# EasyEDA schematic SCH.json

## Sheets
1 Main: TITLE: Main; REV: 1.0; Date: 2022-08-12; Sheet: 1/1; Drawn By: joetelaa0; Company: Your Company
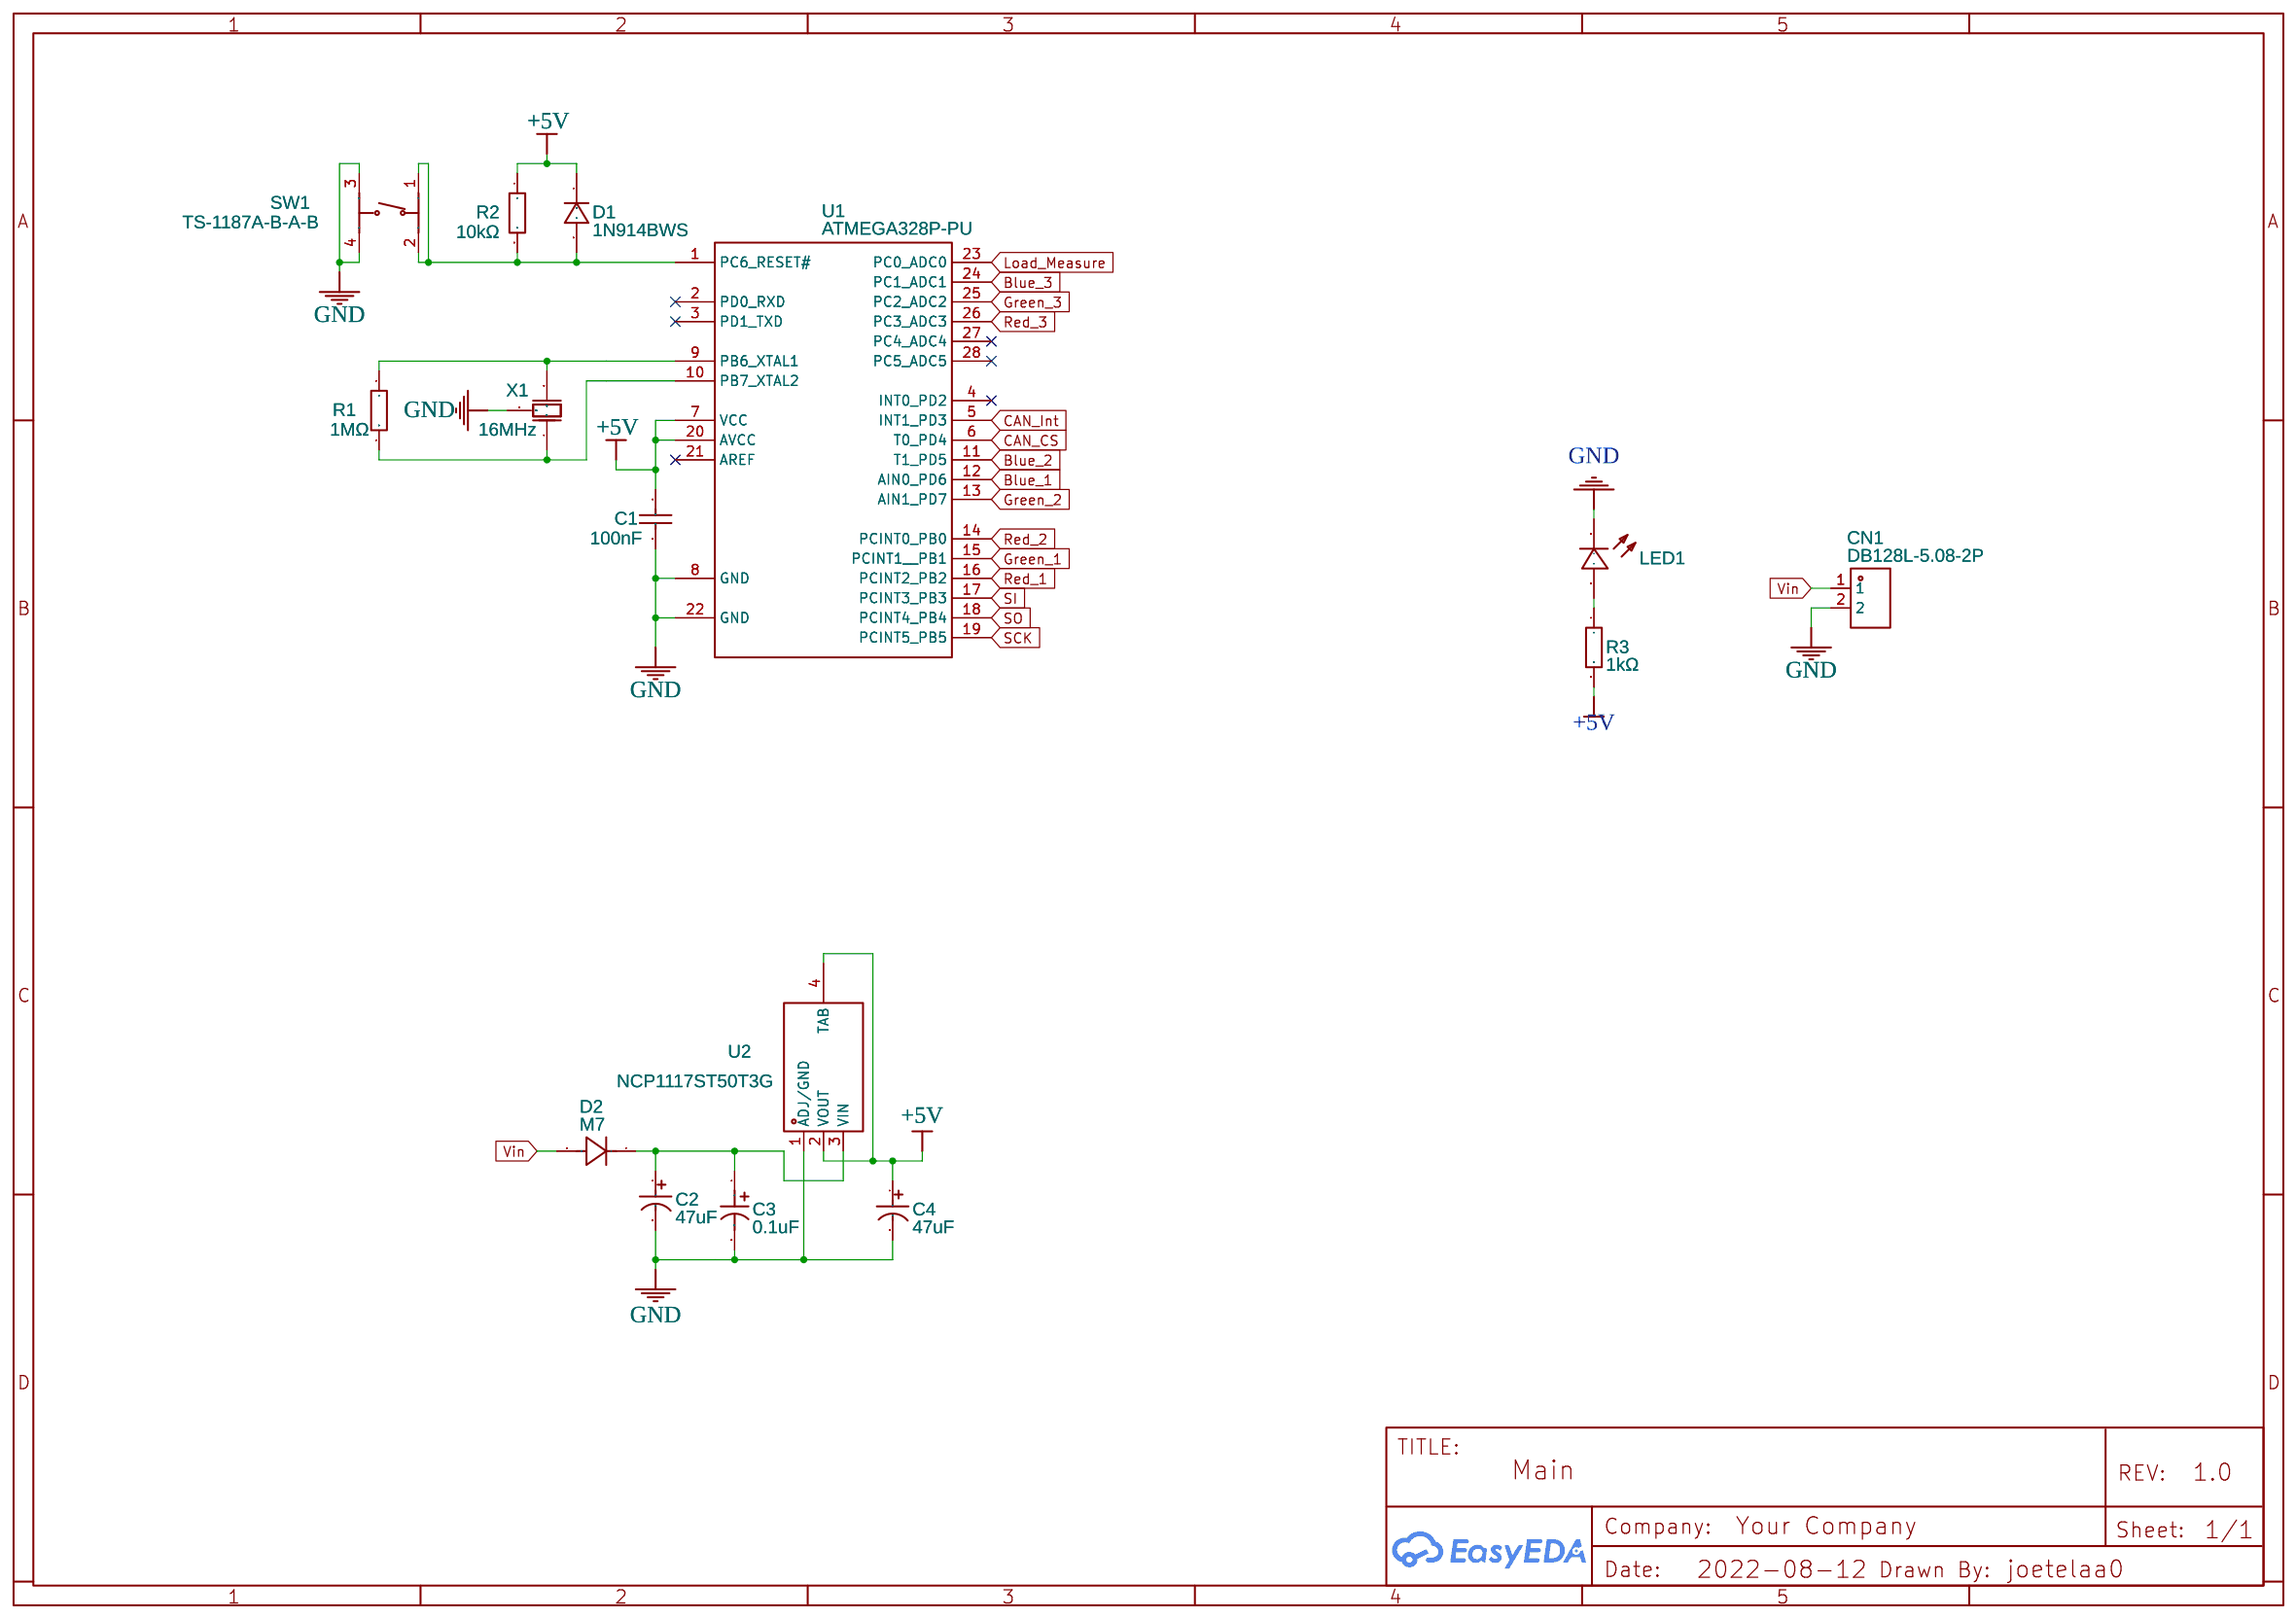
[diagram p0: Main]
2 LED Driver: TITLE: LED Driver
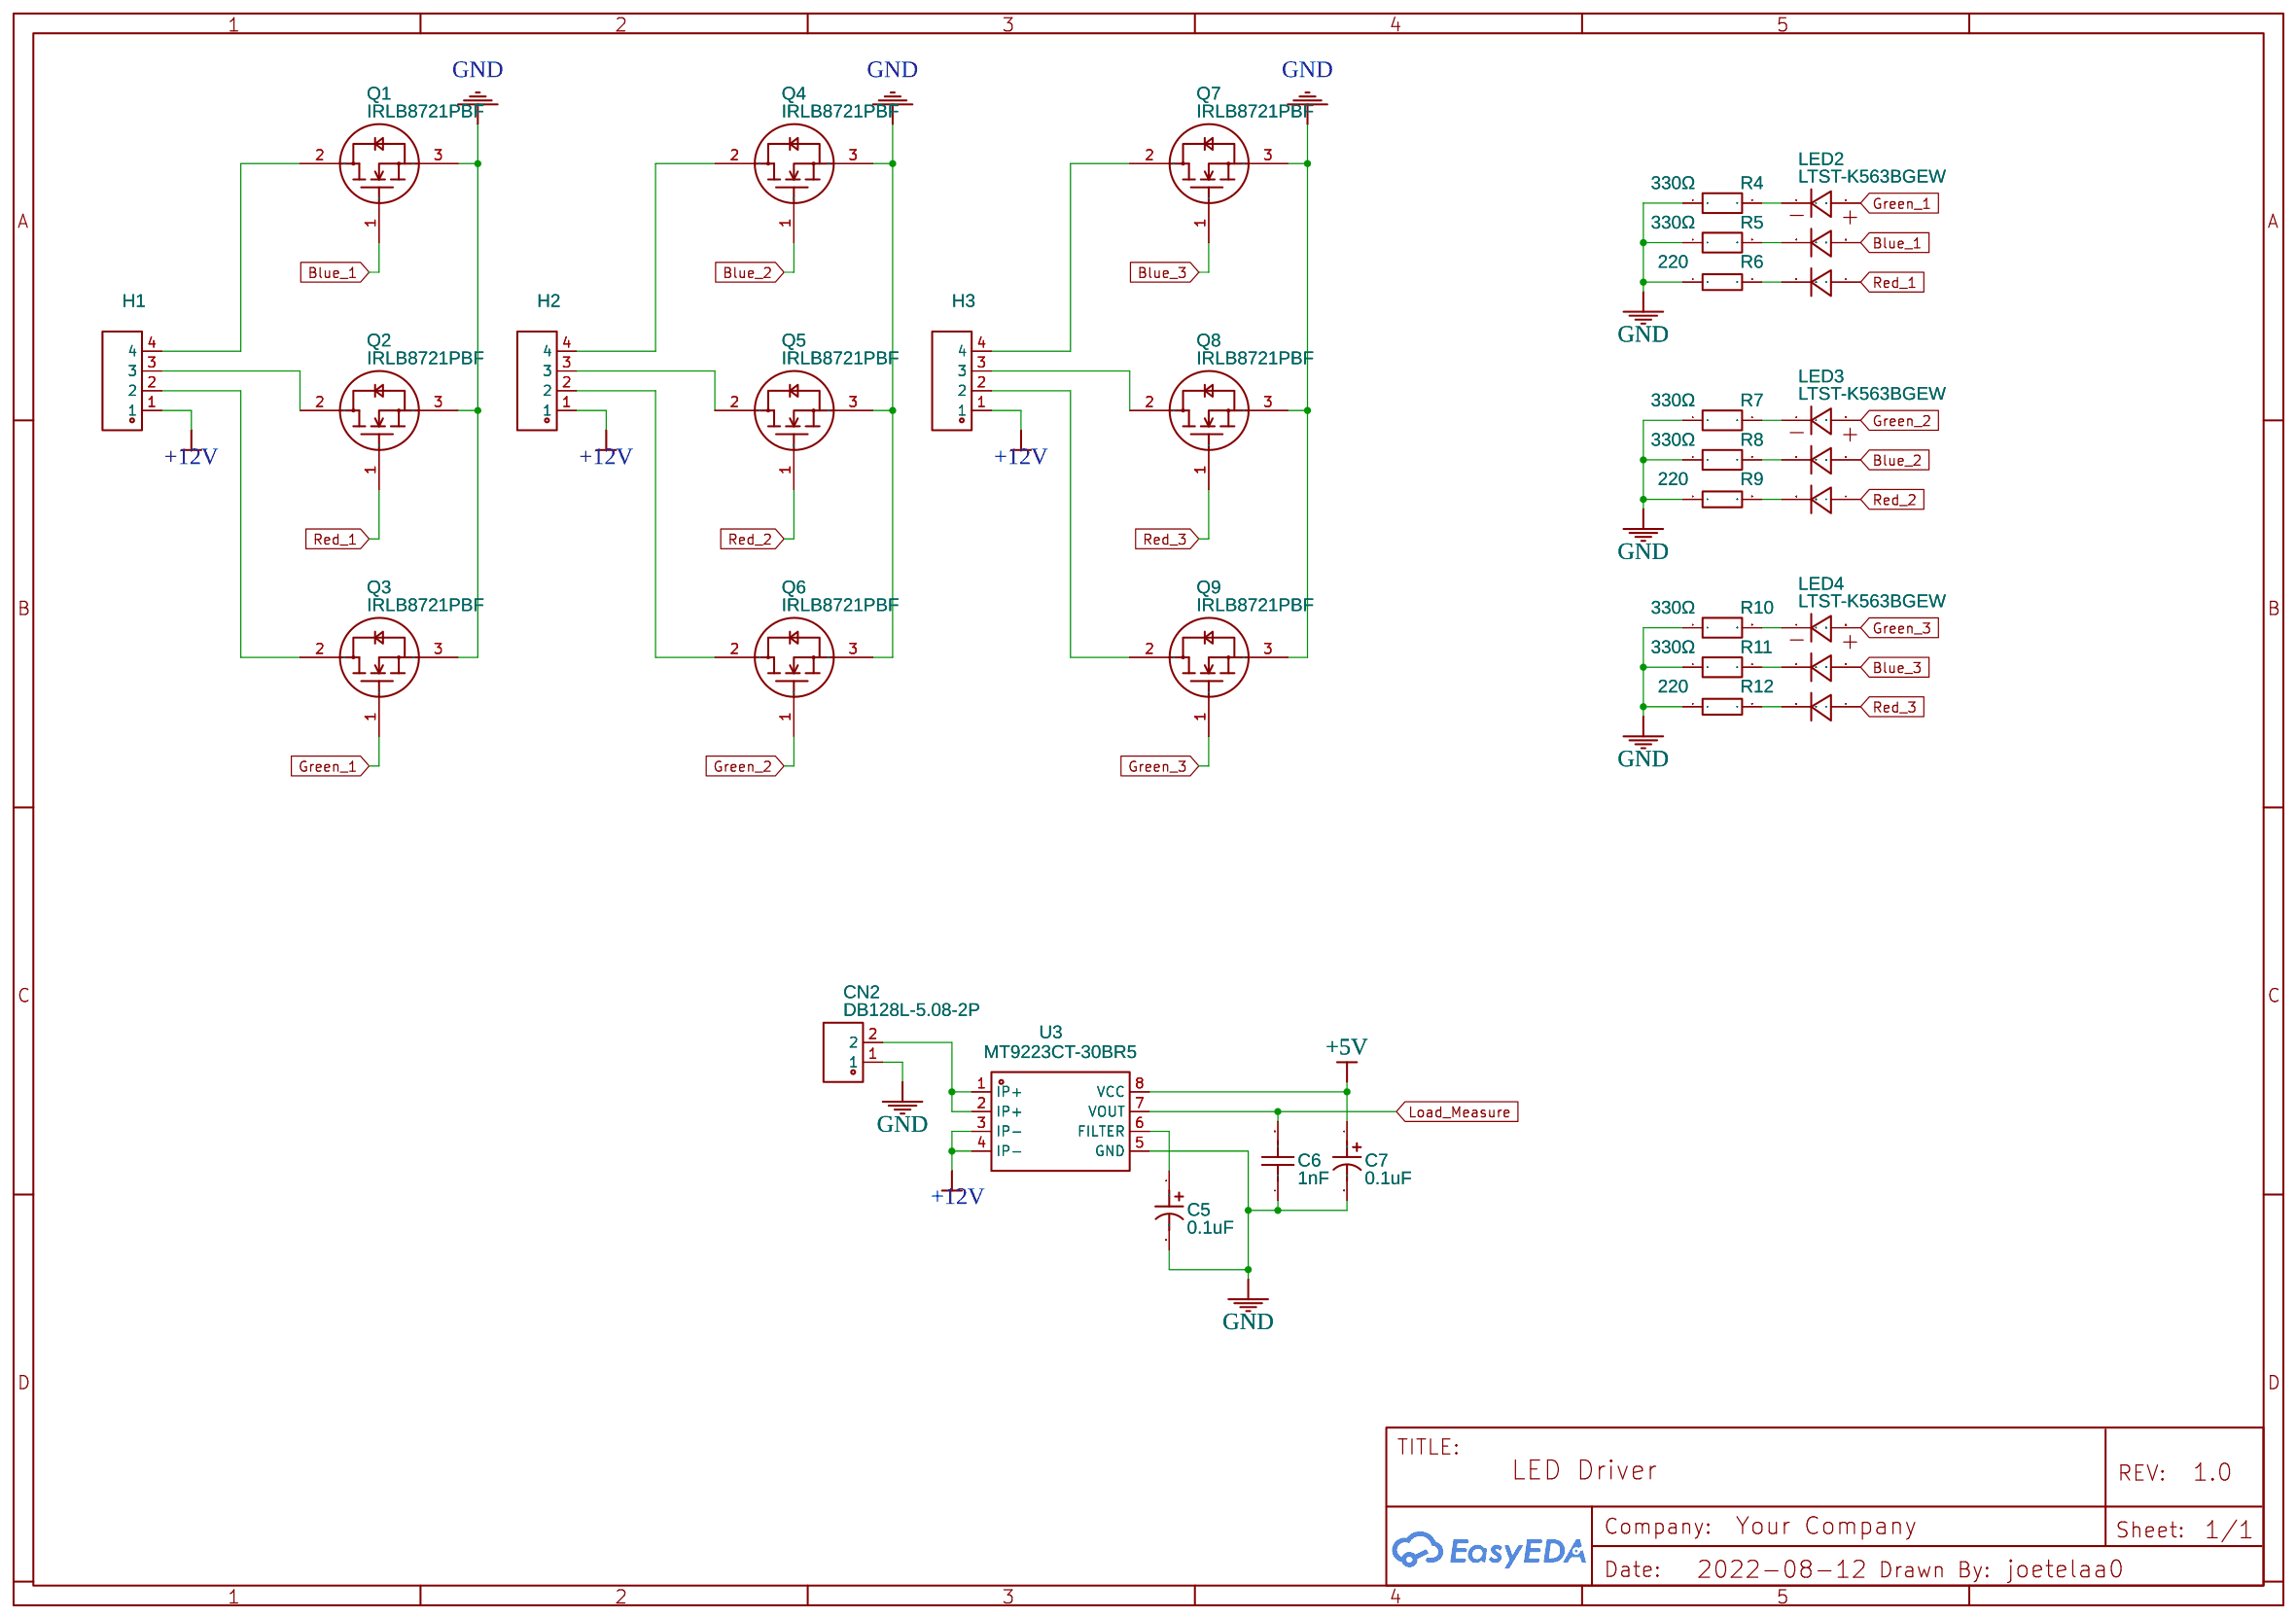
[diagram p1: LED Driver]
3 CAN: TITLE: CAN
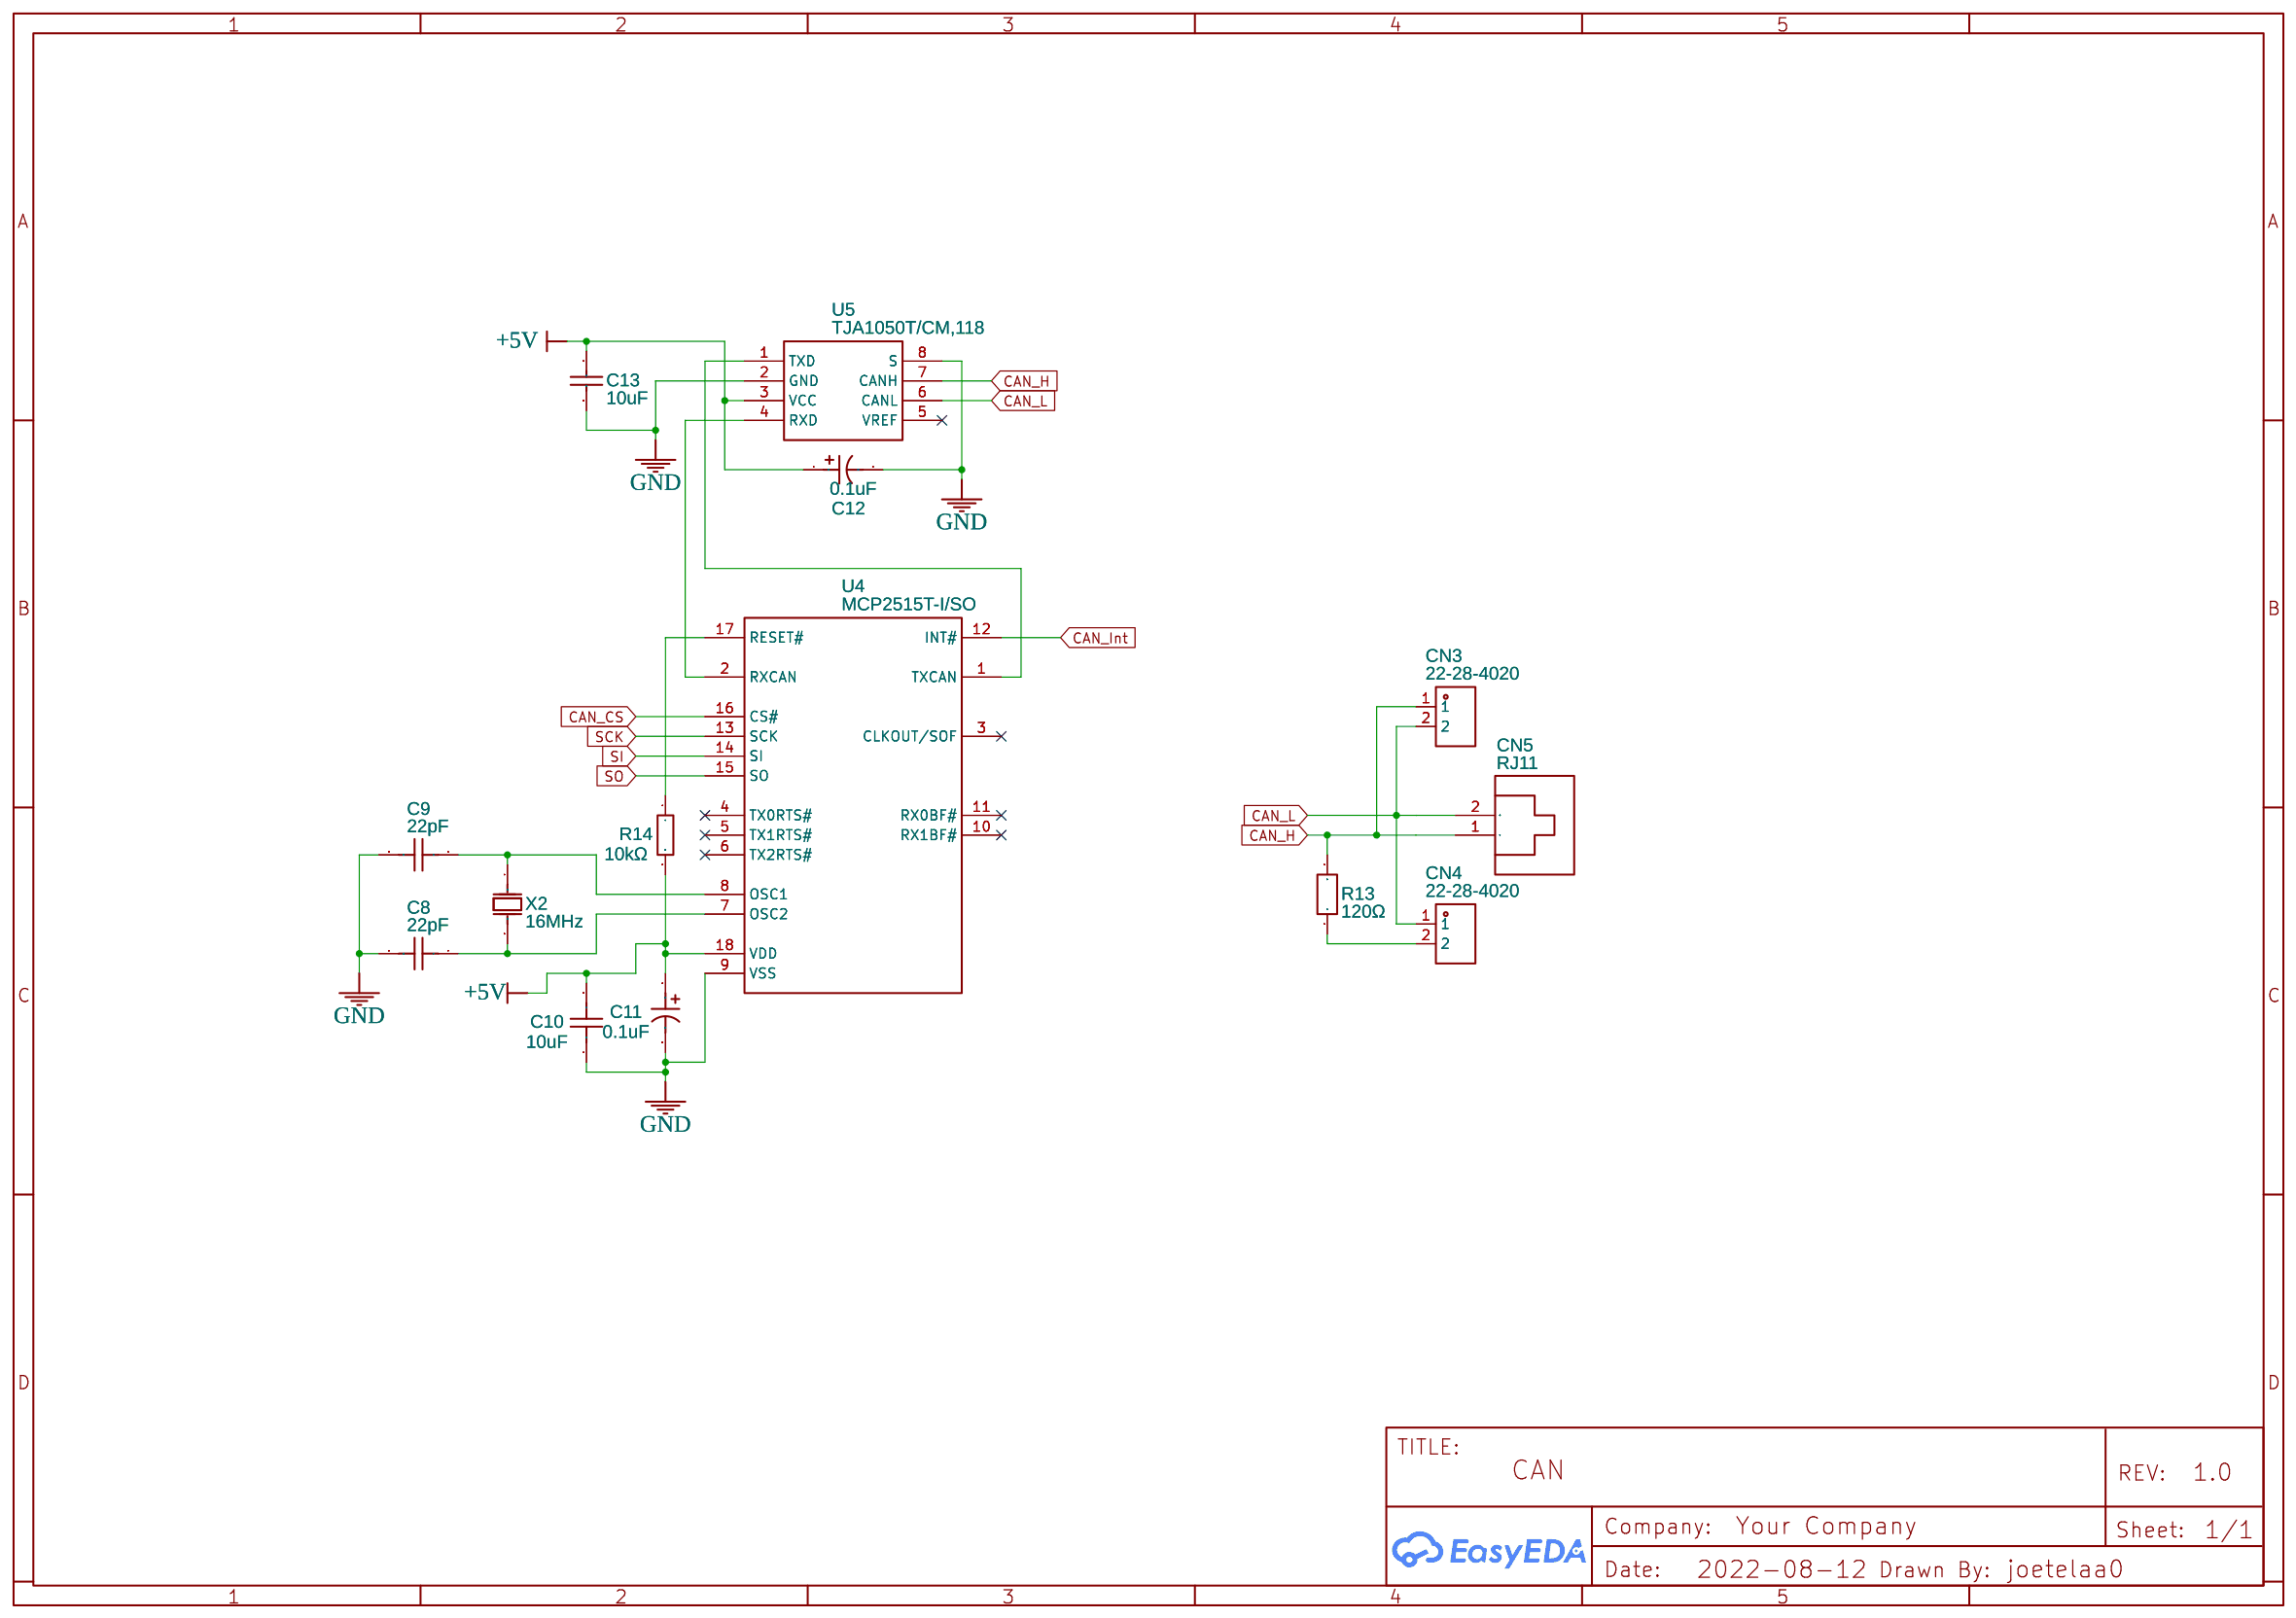
[diagram p2: CAN]

## Parts
sheet CAN
C8  22pF  [C0603]
C9  22pF  [C0603]
C10  10uF  [C1206]
C11  0.1uF  [CAP-SMD_L3.2-W1.6-RD]
C12  0.1uF  [CAP-SMD_L3.2-W1.6-RD]
C13  10uF  [C0603]
CN3  22-28-4020  [HDR-TH_2P-P2.54-V-M-1]
CN4  22-28-4020  [HDR-TH_2P-P2.54-V-M-1]
CN5  RJ11  [RJ11-TH_55A-1X1-6P2C-E-13H]
R13  120Ω  [R0603]
R14  10kΩ  [R0603]
U4  MCP2515T-I/SO  [SOIC-18_L11.6-W7.5-P1.27-LS10.3-BL]
U5  TJA1050T/CM,118  [SOIC-8_L5.0-W4.0-P1.27-LS6.0-BL]
X2  16MHz  [OSC-TH_L10.0-W4.5-P5.00]
sheet LED Driver
C5  0.1uF  [CAP-SMD_L3.2-W1.6-RD]
C6  1nF  [C0603]
C7  0.1uF  [CAP-SMD_L3.2-W1.6-RD]
CN2  DB128L-5.08-2P  [CONN-TH_2P-P5.08_DB128L-5.08-2P]
H1  X6511WV-04H-C30D60  [HDR-TH_4P-P2.54-V-M]
H2  X6511WV-04H-C30D60  [HDR-TH_4P-P2.54-V-M]
H3  X6511WV-04H-C30D60  [HDR-TH_4P-P2.54-V-M]
LED2  LTST-K563BGEW  [LED-ARRAY-SMD_6P-L5.0-W5.0-P1.60-LS5.3-TR]
LED3  LTST-K563BGEW  [LED-ARRAY-SMD_6P-L5.0-W5.0-P1.60-LS5.3-TR]
LED4  LTST-K563BGEW  [LED-ARRAY-SMD_6P-L5.0-W5.0-P1.60-LS5.3-TR]
Q1  IRLB8721PBF  [TO-220-3_L10.0-W4.5-P2.54-L]
Q2  IRLB8721PBF  [TO-220-3_L10.0-W4.5-P2.54-L]
Q3  IRLB8721PBF  [TO-220-3_L10.0-W4.5-P2.54-L]
Q4  IRLB8721PBF  [TO-220-3_L10.0-W4.5-P2.54-L]
Q5  IRLB8721PBF  [TO-220-3_L10.0-W4.5-P2.54-L]
Q6  IRLB8721PBF  [TO-220-3_L10.0-W4.5-P2.54-L]
Q7  IRLB8721PBF  [TO-220-3_L10.0-W4.5-P2.54-L]
Q8  IRLB8721PBF  [TO-220-3_L10.0-W4.5-P2.54-L]
Q9  IRLB8721PBF  [TO-220-3_L10.0-W4.5-P2.54-L]
R4  330Ω  [R0603]
R5  330Ω  [R0603]
R6  220  [R0603]
R7  330Ω  [R0603]
R8  330Ω  [R0603]
R9  220  [R0603]
R10  330Ω  [R0603]
R11  330Ω  [R0603]
R12  220  [R0603]
U3  MT9223CT-30BR5  [SOP-8_L4.9-W3.9-P1.27-LS6.0-BL]
sheet Main
C1  100nF  [C0603]
C2  47uF  [CAP-SMD_BD6.3-L6.6-W6.6-FD]
C3  0.1uF  [CAP-SMD_L3.2-W1.6-RD]
C4  47uF  [CAP-SMD_BD6.3-L6.6-W6.6-FD]
CN1  DB128L-5.08-2P  [CONN-TH_2P-P5.08_DB128L-5.08-2P]
D1  1N914BWS  [SOD-323_L1.8-W1.3-LS2.5-RD]
D2  M7  [SMA_L4.4-W2.8-LS5.4-RD]
LED1  FC-1608GHK-570A08  [LED0603-R-RD]
R1  1MΩ  [R0603]
R2  10kΩ  [R0603]
R3  1kΩ  [R0603]
SW1  TS-1187A-B-A-B  [SW-SMD_4P-L5.1-W5.1-P3.70-LS6.5-TL-2]
U1  ATMEGA328P-PU  [DIP-28_L34.6-W7.3-P2.54-LS10.2-BL]
U2  NCP1117ST50T3G  [SOT-223_L6.5-W3.5-P2.30-LS7.0-BR]
X1  16MHz  [OSC-SMD_3P-L3.2-W1.3-P1.20-L]

## Library data of the parts
C8 C9 = CGA3E2C0G1H220JT0Y0N: Supplier: LCSC; Supplier Part: C338053; Manufacturer: TDK; Contributor: LCSC; JLCPCB Part Class: Extended Part
C10 = JMK316AB7106KLHT: Supplier: LCSC; Supplier Part: C454108; Manufacturer: Taiyo Yuden; Contributor: LCSC; JLCPCB Part Class: Extended Part
C3 C5 C7 C11 C12 = CA45A-A-35V-0.1UF-K: Supplier: LCSC; Supplier Part: C2976899; Manufacturer: CEC(振华新云); Contributor: LCSC; JLCPCB Part Class: Extended Part
C13 = JMK107BJ106MA-T: Supplier: LCSC; Manufacturer: TAIYO YUDEN; Supplier Part: C87152; JLCPCB Part Class: Extended Part
CN3 CN4 = 22-28-4020: Supplier: LCSC; Supplier Part: C234182; Manufacturer: MOLEX; Contributor: LCSC; JLCPCB Part Class: Extended Part
CN5 = PCB-6P2C-90_C189745: Supplier: LCSC; Supplier Part: C189745; Manufacturer: Shenzhen Cankemeng; Contributor: LCSC; JLCPCB Part Class: Extended Part
R13 = ERJPA3J121V: Supplier: LCSC; Supplier Part: C445808; Manufacturer: PANASONIC; Contributor: LCSC; JLCPCB Part Class: Extended Part
R2 R14 = RMS06FT1002: Supplier: LCSC; Supplier Part: C209013; Manufacturer: TA-I Tech; Resistance (Ohms): 10K; Contributor: LCSC; JLCPCB Part Class: Extended Part
U4 = MCP2515T-I/SO: Supplier: LCSC; Manufacturer: MICROCHIP; Contributor: LCSC; Supplier Part: C153782; JLCPCB Part Class: Extended Part
U5 = TJA1050T/CM,118: Supplier: LCSC; Manufacturer: NXP; Supplier Part: C6952; JLCPCB Part Class: Basic Part
X2 = X49SD16MSD2SC: Supplier: LCSC; Manufacturer: YXC; Supplier Part: C16212; JLCPCB Part Class: Extended Part
C6 = GRM1885C1H102JA01D: Supplier: LCSC; Manufacturer: MuRata; Supplier Part: C77026; JLCPCB Part Class: Extended Part
CN1 CN2 = DB128L-5.08-2P: Supplier: LCSC; Supplier Part: C395868; Manufacturer: DIBO; Contributor: LCSC; JLCPCB Part Class: Extended Part
H1-H3 = X6511WV-04H-C30D60: Supplier: LCSC; Supplier Part: C706876; Manufacturer: XKB Connectivity; Contributor: LCSC; JLCPCB Part Class: Extended Part
LED2-LED4 = LTST-K563BGEW: Supplier: LCSC; Supplier Part: C284911; Manufacturer: Lite-On; Contributor: LCSC; JLCPCB Part Class: Extended Part
Q1-Q9 = IRLB8721PBF: Supplier: LCSC; Manufacturer: Infineon; Contributor: LCSC; Supplier Part: C153222; JLCPCB Part Class: Extended Part
R4 R5 R7 R8 R10 R11 = FRC0603F3300TS: Supplier: LCSC; Supplier Part: C2933198; Manufacturer: FOJAN(富捷); Contributor: lcsc
R6 R9 R12 = AF0603FR-07220RL: Supplier: LCSC; Supplier Part: C144094; Manufacturer: YAGEO; Contributor: LCSC; JLCPCB Part Class: Extended Part; Resistance: 220Ω
U3 = MT9223CT-30BR5: Supplier: LCSC; Supplier Part: C879636; Manufacturer: Magn Tek; Contributor: LCSC; JLCPCB Part Class: Extended Part
C1 = FN18X104K500PBG: Supplier: LCSC; Supplier Part: C235731; Manufacturer: Prosperity Dielectrics; Contributor: LCSC; JLCPCB Part Class: Extended Part
C2 C4 = RVT1V470M0605_c72522: Supplier: LCSC; Manufacturer: ROQANG; Manufacturer Part: RVT1V470M0605; Supplier Part: C72522; JLCPCB Part Class: Extended Part
D1 = 1N914BWS: Supplier: LCSC; Supplier Part: C258181; Manufacturer: ON Semicon; Contributor: LCSC; JLCPCB Part Class: Extended Part
D2 = 1N4007_C727081: Supplier: LCSC; Supplier Part: C727081; Manufacturer: TWGMC; Manufacturer Part: 1N4007; Contributor: LCSC; JLCPCB Part Class: Extended Part
LED1 = FC-1608GHK-570A08: Supplier: LCSC; Supplier Part: C193901; Manufacturer: Foshan NationStar Optoelectronics; Contributor: LCSC; JLCPCB Part Class: Extended Part
R1 = ERJ-3EKF1004V: Supplier: LCSC; Supplier Part: C193390; Manufacturer: PANASONIC; Resistance (Ohms): 1M; Contributor: LCSC; JLCPCB Part Class: Extended Part
R3 = TR0603B1KP0525: Supplier: LCSC; Supplier Part: C188364; Manufacturer: Ever Ohms Tech; Resistance (Ohms): 1K; Contributor: LCSC; JLCPCB Part Class: Extended Part
SW1 = TS-1187A-B-A-B: Supplier: LCSC; Supplier Part: C318884; Manufacturer: XKB Enterprise; Contributor: LCSC; JLCPCB Part Class: Basic Part
U1 = ATMEGA328P-PU: sourceId: Oic6oiASL; Supplier: LCSC; Manufacturer: MICROCHIP; Contributor: LCSC; Supplier Part: C33901; JLCPCB Part Class: Extended Part
U2 = NCP1117ST50T3G: Supplier: LCSC; Manufacturer: ON; Supplier Part: C17314; JLCPCB Part Class: Extended Part
X1 = CSTNE16M0V53C000R0: Supplier: LCSC; Supplier Part: C882606; Manufacturer: muRata(村田); Contributor: LCSC; JLCPCB Part Class: Extended Part

## Nets
+5V: C1.2 C4.1 C7.1 C10.2 C11.1 C12.1 C13.2 D1.1(C) R2.1 R3.2 R14.2 U1.7(VCC) U1.20(AVCC) U2.2(VOUT) U2.4(TAB) U3.8(VCC) U4.18(VDD) U5.3(VCC)
+12V: H1.1 H2.1 H3.1 U3.3(IP-) U3.4(IP-)
GND: C1.1 C2.2 C3.2 C4.2 C5.2 C6.1 C7.2 C8.2 C9.2 C10.1 C11.2 C12.2 C13.1 CN1.2 CN2.1 LED1.2(-) Q1.3(S) Q2.3(S) Q3.3(S) Q4.3(S) Q5.3(S) Q6.3(S) Q7.3(S) Q8.3(S) Q9.3(S) R4.1 R5.1 R6.1 R7.1 R8.1 R9.1 R10.1 R11.1 R12.1 SW1.3(C) SW1.4(D) U1.8(GND) U1.22(GND) U2.1(ADJ/GND) U3.5(GND) U4.9(VSS) U5.2(GND) U5.8(S) X1.2(GND)
Vin: CN1.1 D2.2(A)
Blue_1: LED2.5 Q1.1(G) U1.12(AIN0 PD6)
Blue_2: LED3.5 Q4.1(G) U1.11(T1 PD5)
Blue_3: LED4.5 Q7.1(G) U1.24(PC1 ADC1)
CAN_CS: U1.6(T0 PD4) U4.16(CS#)
CAN_H: CN3.1 CN5.1 R13.2 U5.7(CANH)
CAN_Int: U1.5(INT1 PD3) U4.12(INT#)
CAN_L: CN3.2 CN4.1 CN5.2 U5.6(CANL)
Green_1: LED2.6 Q3.1(G) U1.15(PCINT1  PB1)
Green_2: LED3.6 Q6.1(G) U1.13(AIN1 PD7)
Green_3: LED4.6 Q9.1(G) U1.25(PC2 ADC2)
Load_Measure: C6.2 U1.23(PC0 ADC0) U3.7(VOUT)
Red_1: LED2.4 Q2.1(G) U1.16(PCINT2 PB2)
Red_2: LED3.4 Q5.1(G) U1.14(PCINT0 PB0)
Red_3: LED4.4 Q8.1(G) U1.26(PC3 ADC3)
SCK: U1.19(PCINT5 PB5) U4.13(SCK)
SI: U1.17(PCINT3 PB3) U4.14(SI)
SO: U1.18(PCINT4 PB4) U4.15(SO)
Net-(C2-1): C2.1 C3.1 D2.1(K) U2.3(VIN)
Net-(C5-1): C5.1 U3.6(FILTER)
Net-(C8-1): C8.1 U4.7(OSC2) X2.2(OSC2)
Net-(C9-1): C9.1 U4.8(OSC1) X2.1(OSC1)
Net-(CN2-2): CN2.2 U3.1(IP+) U3.2(IP+)
Net-(CN4-2): CN4.2 R13.1
Net-(D1-2): D1.2(A) R2.2 SW1.1(A) SW1.2(B) U1.1(PC6 RESET#)
Net-(H1-2): H1.2 Q3.2(D)
Net-(H1-3): H1.3 Q2.2(D)
Net-(H1-4): H1.4 Q1.2(D)
Net-(H2-2): H2.2 Q6.2(D)
Net-(H2-3): H2.3 Q5.2(D)
Net-(H2-4): H2.4 Q4.2(D)
Net-(H3-2): H3.2 Q9.2(D)
Net-(H3-3): H3.3 Q8.2(D)
Net-(H3-4): H3.4 Q7.2(D)
Net-(LED1-1): LED1.1(+) R3.1
Net-(LED2-1): LED2.1 R4.2
Net-(LED2-2): LED2.2 R5.2
Net-(LED2-3): LED2.3 R6.2
Net-(LED3-1): LED3.1 R7.2
Net-(LED3-2): LED3.2 R8.2
Net-(LED3-3): LED3.3 R9.2
Net-(LED4-1): LED4.1 R10.2
Net-(LED4-2): LED4.2 R11.2
Net-(LED4-3): LED4.3 R12.2
Net-(R1-1): R1.1 U1.9(PB6 XTAL1) X1.3(OSC2)
Net-(R1-2): R1.2 U1.10(PB7 XTAL2) X1.1(OSC1)
Net-(R14-1): R14.1 U4.17(RESET#)
Net-(U4-1): U4.1(TXCAN) U5.1(TXD)
Net-(U4-2): U4.2(RXCAN) U5.4(RXD)

Not connected (* = marked no-connect by the designer): U1 2(PD0 RXD)* 3(PD1 TXD)* 4(INT0 PD2)* 21(AREF)* 27(PC4 ADC4)* 28(PC5 ADC5)*; U4 3(CLKOUT/SOF)* 4(TX0RTS#)* 5(TX1RTS#)* 6(TX2RTS#)* 10(RX1BF#)* 11(RX0BF#)*; U5 5(VREF)*
